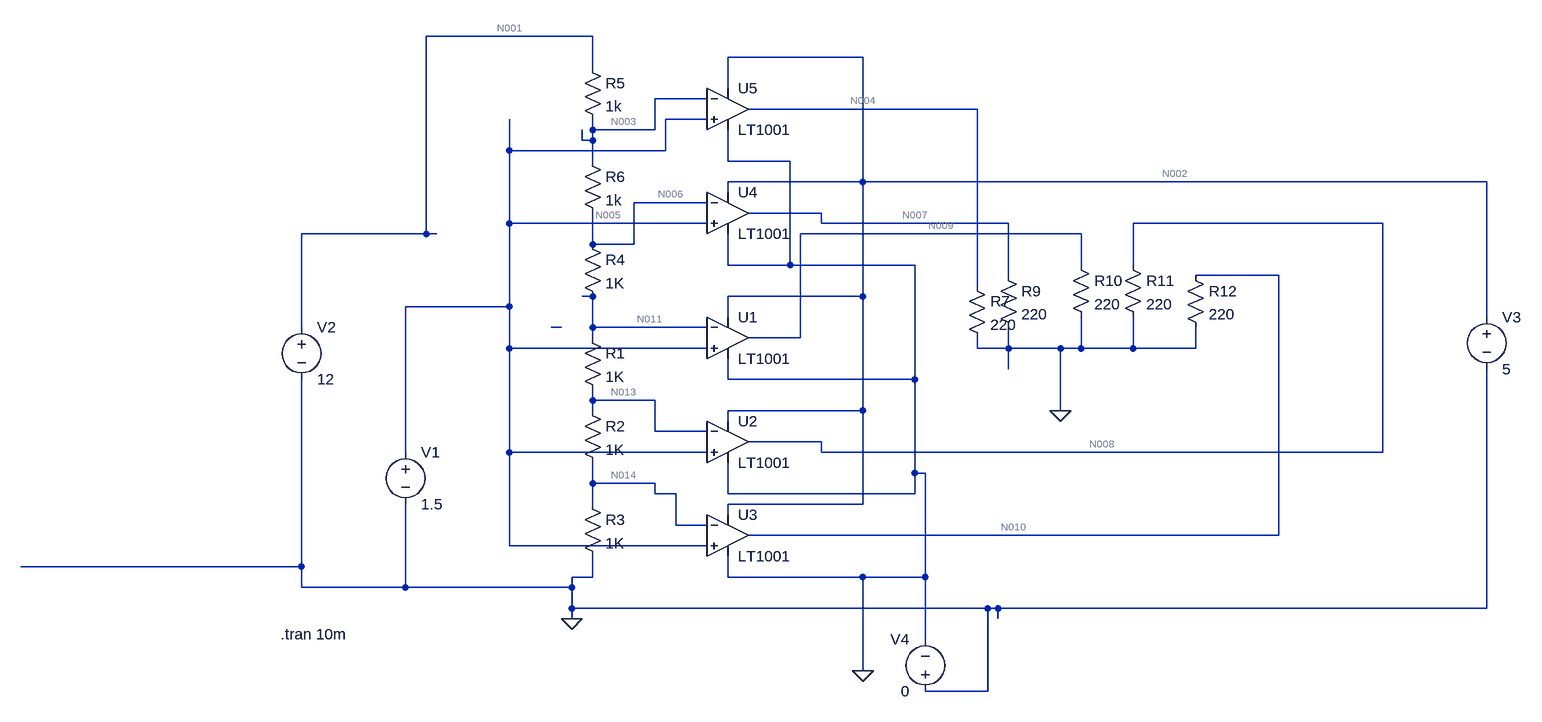
[diagram p0: schematic 9-Windows.asc]
9-Windows.asc, the LTspice schematic file:
Version 4
SHEET 1 1640 680
WIRE 208 -400 -48 -400
WIRE 624 -368 416 -368
WIRE 208 -352 208 -400
WIRE 416 -320 416 -368
WIRE 384 -304 304 -304
WIRE 800 -288 448 -288
WIRE 384 -272 320 -272
WIRE 208 -256 208 -272
WIRE 304 -256 304 -304
WIRE 304 -256 208 -256
WIRE 192 -240 192 -256
WIRE 208 -240 208 -256
WIRE 208 -240 192 -240
WIRE 80 -224 80 -272
WIRE 320 -224 320 -272
WIRE 320 -224 80 -224
WIRE 208 -208 208 -240
WIRE 416 -208 416 -256
WIRE 512 -208 416 -208
WIRE 624 -176 624 -368
WIRE 624 -176 416 -176
WIRE 1584 -176 624 -176
WIRE 416 -160 416 -176
WIRE 384 -144 272 -144
WIRE 560 -128 448 -128
WIRE 80 -112 80 -224
WIRE 384 -112 80 -112
WIRE 560 -112 560 -128
WIRE 848 -112 560 -112
WIRE 1424 -112 1040 -112
WIRE -48 -96 -48 -400
WIRE -48 -96 -240 -96
WIRE -32 -96 -48 -96
WIRE 960 -96 528 -96
WIRE 208 -80 208 -128
WIRE 272 -80 272 -144
WIRE 272 -80 208 -80
WIRE 416 -48 416 -96
WIRE 512 -48 512 -208
WIRE 512 -48 416 -48
WIRE 704 -48 512 -48
WIRE 960 -48 960 -96
WIRE 1040 -48 1040 -112
WIRE 848 -32 848 -112
WIRE 1264 -32 1136 -32
WIRE 800 -16 800 -288
WIRE 208 0 192 0
WIRE 624 0 624 -176
WIRE 624 0 416 0
WIRE 80 16 80 -112
WIRE 80 16 -80 16
WIRE 416 32 416 0
WIRE 1584 32 1584 -176
WIRE -240 48 -240 -96
WIRE 160 48 144 48
WIRE 208 48 208 0
WIRE 384 48 208 48
WIRE 208 64 208 48
WIRE 528 64 528 -96
WIRE 528 64 448 64
WIRE 80 80 80 16
WIRE 384 80 80 80
WIRE 800 80 800 64
WIRE 848 80 848 48
WIRE 848 80 800 80
WIRE 928 80 848 80
WIRE 960 80 960 32
WIRE 960 80 928 80
WIRE 1040 80 1040 32
WIRE 1040 80 960 80
WIRE 1136 80 1136 48
WIRE 1136 80 1040 80
WIRE 848 112 848 80
WIRE 416 128 416 96
WIRE 704 128 704 -48
WIRE 704 128 416 128
WIRE 208 160 208 144
WIRE 304 160 208 160
WIRE 208 176 208 160
WIRE 624 176 624 0
WIRE 624 176 416 176
WIRE 928 176 928 80
WIRE 416 192 416 176
WIRE 304 208 304 160
WIRE 384 208 304 208
WIRE 560 224 448 224
WIRE -80 240 -80 16
WIRE 80 240 80 80
WIRE 384 240 80 240
WIRE 560 240 560 224
WIRE 1424 240 1424 -112
WIRE 1424 240 560 240
WIRE 704 272 704 128
WIRE 720 272 704 272
WIRE 208 288 208 256
WIRE 304 288 208 288
WIRE 304 304 304 288
WIRE 336 304 304 304
WIRE 416 304 416 256
WIRE 704 304 704 272
WIRE 704 304 416 304
WIRE 208 320 208 288
WIRE 624 320 624 176
WIRE 624 320 416 320
WIRE 416 336 416 320
WIRE 336 352 336 304
WIRE 384 352 336 352
WIRE 1264 368 1264 -32
WIRE 1264 368 448 368
WIRE 80 384 80 240
WIRE 384 384 80 384
WIRE -240 416 -240 128
WIRE -240 416 -672 416
WIRE 208 432 208 400
WIRE 208 432 176 432
WIRE 416 432 416 400
WIRE 624 432 416 432
WIRE 720 432 720 272
WIRE 720 432 624 432
WIRE -240 448 -240 416
WIRE -80 448 -80 320
WIRE -80 448 -240 448
WIRE 176 448 176 432
WIRE 176 448 -80 448
WIRE 176 480 176 448
WIRE 816 480 176 480
WIRE 832 480 816 480
WIRE 1584 480 1584 112
WIRE 1584 480 832 480
WIRE 176 496 176 480
WIRE 832 496 832 480
WIRE 720 528 720 432
WIRE 624 576 624 432
WIRE 816 608 816 480
WIRE 816 608 720 608
FLAG 176 496 0
FLAG 928 176 0
FLAG 624 576 0
SYMBOL res 192 48 R0
SYMATTR InstName R1
SYMATTR Value 1K
SYMBOL res 192 160 R0
SYMATTR InstName R2
SYMATTR Value 1K
SYMBOL res 192 304 R0
SYMATTR InstName R3
SYMATTR Value 1K
SYMBOL Opamps\\LT1001 416 0 R0
SYMATTR InstName U1
SYMBOL Opamps\\LT1001 416 160 R0
SYMATTR InstName U2
SYMBOL Opamps\\LT1001 416 304 R0
SYMATTR InstName U3
SYMBOL res 192 -96 R0
SYMATTR InstName R4
SYMATTR Value 1K
SYMBOL voltage -240 32 R0
WINDOW 123 0 0 Left 0
WINDOW 39 0 0 Left 0
SYMATTR InstName V2
SYMATTR Value 12
SYMBOL Opamps\\LT1001 416 -192 R0
SYMATTR InstName U4
SYMBOL res 192 -224 R0
SYMATTR InstName R6
SYMATTR Value 1k
SYMBOL res 832 -48 R0
SYMATTR InstName R9
SYMATTR Value 220
SYMBOL res 944 -64 R0
SYMATTR InstName R10
SYMATTR Value 220
SYMBOL res 1024 -64 R0
SYMATTR InstName R11
SYMATTR Value 220
SYMBOL res 1120 -48 R0
SYMATTR InstName R12
SYMATTR Value 220
SYMBOL voltage 1584 16 R0
SYMATTR InstName V3
SYMATTR Value 5
SYMBOL voltage 720 624 R180
WINDOW 0 24 96 Left 2
WINDOW 3 24 16 Left 2
SYMATTR InstName V4
SYMATTR Value 0
SYMBOL voltage -80 224 R0
WINDOW 123 0 0 Left 0
WINDOW 39 0 0 Left 0
SYMATTR InstName V1
SYMATTR Value 1.5
SYMBOL Opamps\\LT1001 416 -352 R0
SYMATTR InstName U5
SYMBOL res 192 -368 R0
SYMATTR InstName R5
SYMATTR Value 1k
SYMBOL res 784 -32 R0
SYMATTR InstName R7
SYMATTR Value 220
TEXT -272 520 Left 2 !.tran 10m

The netlist it stands for:
* 9-Windows.asc
R1 N011 N013 1K
R2 N013 N014 1K
R3 N014 0 1K
XU1 N005 N011 N002 0 N009 LT1001  ; pins In+ In- V+ V- OUT
XU2 N005 N013 N002 0 N008 LT1001  ; pins In+ In- V+ V- OUT
XU3 N005 N014 N002 0 N010 LT1001  ; pins In+ In- V+ V- OUT
R4 N006 N011 1K
V2 N001 0 12
XU4 N005 N006 N002 0 N007 LT1001  ; pins In+ In- V+ V- OUT
R6 N003 N006 1k
R9 N007 0 220
R10 N009 0 220
R11 N008 0 220
R12 N010 0 220
V3 N002 0 5
V4 0 0 0
V1 N005 0 1.5
XU5 N005 N003 N002 0 N004 LT1001  ; pins In+ In- V+ V- OUT
R5 N001 N003 1k
R7 N004 0 220
.tran 10m
.lib LTC.lib
.backanno
.end

* Results of the author's LTspice run, read from the files saved beside the schematic
* Operating Point, zero values left out:
*   V(n011) = 3.096 V
*   V(n013) = 2.064 V
*   V(n014) = 1.032 V
*   V(n005) = 1.5 V
*   V(n002) = 5 V
*   V(n009) = 801.4 mV
*   V(n008) = 801.4 mV
*   V(n010) = 3.51 V
*   V(n006) = 4.282 V
*   V(n001) = 12 V
*   V(n007) = 801.4 mV
*   V(n003) = 6.583 V
*   V(n004) = 801.4 mV
*   I(R7) = 3.643 mA
*   I(R5) = 5.417 mA
*   I(R12) = 15.95 mA
*   I(R11) = 3.643 mA
*   I(R10) = 3.643 mA
*   I(R9) = 3.643 mA
*   I(R6) = 2.301 mA
*   I(R4) = 1.186 mA
*   I(R3) = 1.032 mA
*   I(R2) = 1.032 mA
*   I(R1) = 1.032 mA
*   I(V1) = 4.385 mA
*   I(V3) = -33.73 mA
*   I(V2) = -5.417 mA